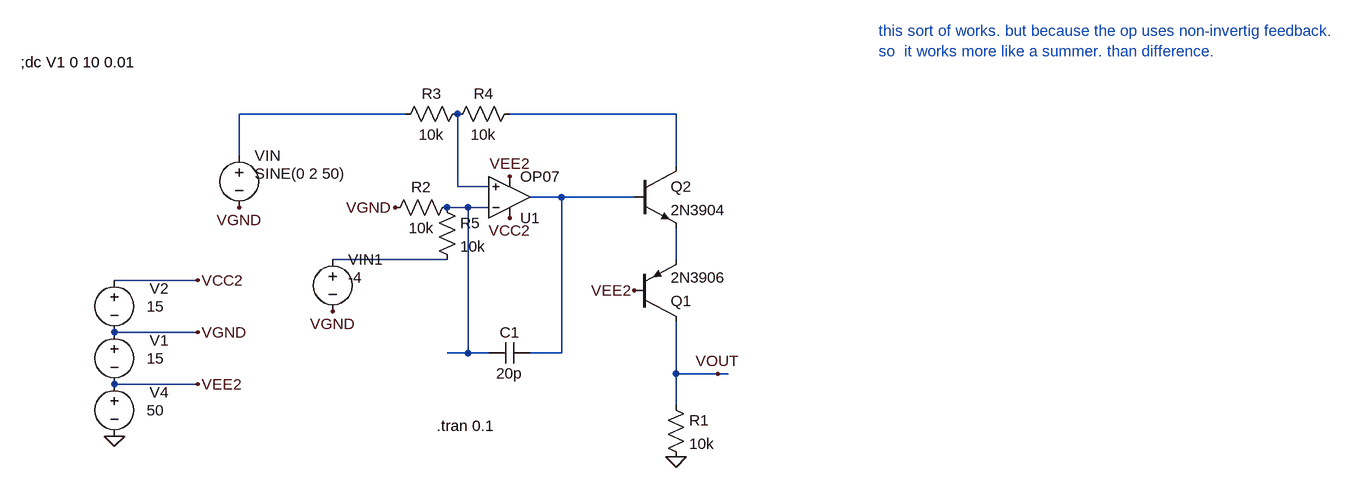
[diagram p0: schematic Draft16.asc]
Draft16.asc, the LTspice schematic file:
Version 4
SHEET 1 1896 680
WIRE 256 -32 0 -32
WIRE 672 -32 416 -32
WIRE 0 32 0 -32
WIRE 672 48 672 -32
WIRE 336 80 336 -32
WIRE 384 80 336 80
WIRE 496 96 448 96
WIRE 608 96 496 96
WIRE 352 112 320 112
WIRE 384 112 352 112
WIRE 320 192 144 192
WIRE 672 192 672 144
WIRE -64 224 -192 224
WIRE -64 304 -192 304
WIRE 352 336 352 112
WIRE 352 336 320 336
WIRE 384 336 352 336
WIRE 496 336 496 96
WIRE 496 336 448 336
WIRE 672 368 672 288
WIRE 736 368 672 368
WIRE 752 368 736 368
WIRE -64 384 -192 384
WIRE 672 416 672 368
FLAG -192 464 0
FLAG -64 384 VEE2
FLAG -64 224 VCC2
FLAG 672 496 0
FLAG 416 64 VEE2
FLAG 416 128 VCC2
FLAG 736 368 VOUT
FLAG -64 304 VGND
FLAG 0 112 VGND
FLAG 240 112 VGND
FLAG 608 240 VEE2
FLAG 144 272 VGND
SYMBOL voltage 0 16 R0
WINDOW 123 0 0 Left 0
WINDOW 39 0 0 Left 0
WINDOW 3 24 44 Left 2
SYMATTR Value SINE(0 2 50)
SYMATTR InstName VIN
SYMBOL voltage -192 368 R0
WINDOW 0 54 29 Left 2
WINDOW 3 50 56 Left 2
WINDOW 123 0 0 Left 0
WINDOW 39 0 0 Left 0
SYMATTR InstName V4
SYMATTR Value 50
SYMBOL pnp 608 288 M180
SYMATTR InstName Q1
SYMATTR Value 2N3906
SYMBOL voltage -192 288 R0
WINDOW 0 54 29 Left 2
WINDOW 3 50 56 Left 2
WINDOW 123 0 0 Left 0
WINDOW 39 0 0 Left 0
SYMATTR InstName V1
SYMATTR Value 15
SYMBOL res 656 400 R0
SYMATTR InstName R1
SYMATTR Value 10k
SYMBOL res 352 -48 R90
WINDOW 0 0 56 VBottom 2
WINDOW 3 32 56 VTop 2
SYMATTR InstName R3
SYMATTR Value 10k
SYMBOL res 432 -48 R90
WINDOW 0 0 56 VBottom 2
WINDOW 3 32 56 VTop 2
SYMATTR InstName R4
SYMATTR Value 10k
SYMBOL npn 608 48 R0
SYMATTR InstName Q2
SYMATTR Value 2N3904
SYMBOL voltage -192 208 R0
WINDOW 0 54 29 Left 2
WINDOW 3 50 56 Left 2
WINDOW 123 0 0 Left 0
WINDOW 39 0 0 Left 0
SYMATTR InstName V2
SYMATTR Value 15
SYMBOL OpAmps\\OP07 416 160 M180
SYMATTR InstName U1
SYMBOL cap 448 320 R90
WINDOW 0 0 32 VBottom 2
WINDOW 3 32 32 VTop 2
SYMATTR InstName C1
SYMATTR Value 20p
SYMBOL res 336 96 R90
WINDOW 0 0 56 VBottom 2
WINDOW 3 32 56 VTop 2
SYMATTR InstName R2
SYMATTR Value 10k
SYMBOL res 304 96 R0
SYMATTR InstName R5
SYMATTR Value 10k
SYMBOL voltage 144 176 R0
WINDOW 123 0 0 Left 0
WINDOW 39 0 0 Left 0
WINDOW 3 24 44 Left 2
SYMATTR Value -4
SYMATTR InstName VIN1
TEXT -336 -112 Left 2 !;dc V1 0 10 0.01
TEXT 304 448 Left 2 !.tran 0.1
TEXT 984 -160 Left 2 ;this sort of works. but because the op uses non-invertig feedback.\nso  it works more like a summer. than difference.

The netlist it stands for:
* Draft16.asc
VIN N001 VGND SINE(0 2 50)
V4 VEE2 0 50
Q1 VOUT VEE2 N007 0 2N3906
V1 VGND VEE2 15
R1 VOUT 0 10k
R3 N003 N001 10k
R4 N002 N003 10k
Q2 N002 N004 N007 0 2N3904
V2 VCC2 VGND 15
XU1 N003 N005 VCC2 VEE2 N004 LT1001  ; OP07, pins In+ In- V+ V- OUT
C1 N004 N005 20p
R2 N005 VGND 10k
R5 N005 N006 10k
VIN1 N006 VGND -4
.model NPN NPN
.model PNP PNP
.lib standard.bjt
;dc V1 0 10 0.01
.tran 0.1
* this sort of works. but because the op uses non-invertig feedback.
* so  it works more like a summer. than difference.
.lib LTC.lib
.backanno
.end